# Altium schematic sheet window-watchdog.SchDoc
size A3; DocumentNumber: 40; SheetNumber: 40; SheetTotal: 45; SheetDescription: Window Watchdog
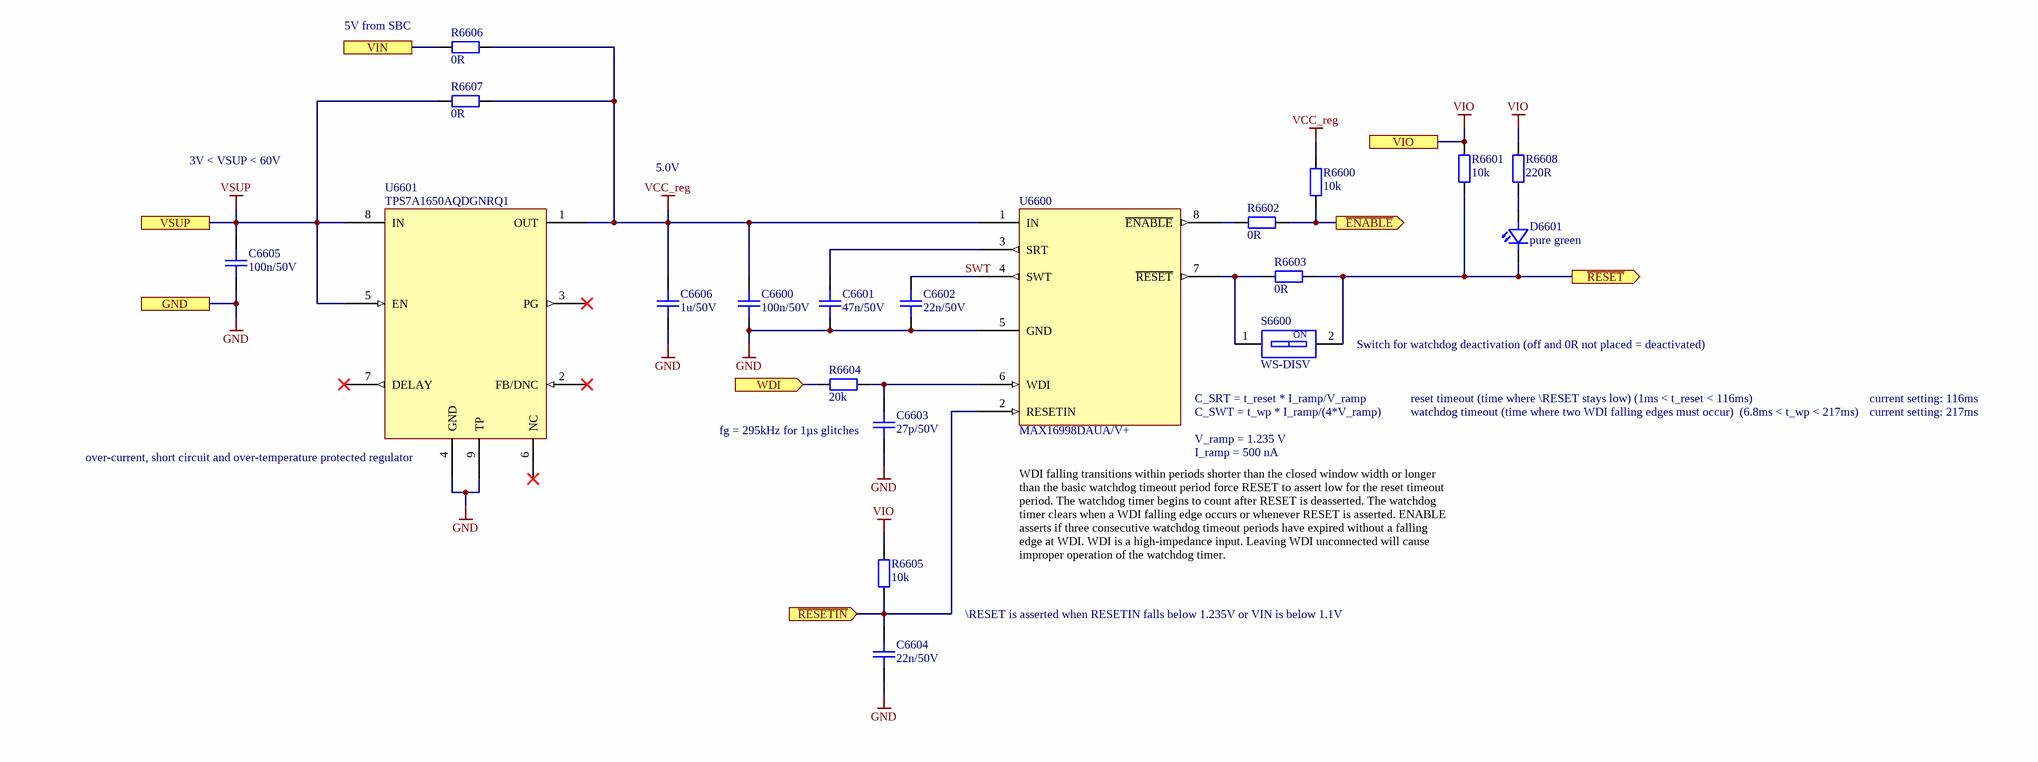
[diagram p0: window-watchdog.SchDoc]

## Parts
C6600  100n/50V  [CAPC1005X06N]
C6601  47n/50V  [CAPC1005X06N]
C6602  22n/50V  [CAPC1005X06N]
C6603  27p/50V  [CAPC1608X08N]
C6604  22n/50V  [CAPC1005X06N]
C6605  100n/50V  [CAPC1005X06N]
C6606  1u/50V  [CAPC1608X08N]
D6601  pure green  [LEDC1608X07N]
R6600  10k  [RESC1005X04N]
R6601  10k  [RESC1005X04N]
R6602  0R  [RESC1005X04N]
R6603  0R  [RESC1005X04N]
R6604  20k  [RESC1005X04N]
R6605  10k  [RESC1005X04N]
R6606  0R  [RESC1005X04N]
R6607  0R  [RESC1005X04N]
R6608  220R  [RESC1005X04N]
S6600  WS-DISV  [WE_416131160801]
U6600  MAX16998DAUA/V+  [MAX16998-uSOP8]
U6601  TPS7A1650AQDGNRQ1  [TPS7A16A-Q1]

## Ports
GND, VIN, VIO, VSUP, WDI (in), ~{ENABLE} (out), ~{RESETIN} (in), ~{RESET} (out)

## Nets
GND: C6600.1 C6601.1 C6602.1 C6603.1 C6604.1 C6605.1 C6606.1 U6600.5(GND) U6601.4(GND) U6601.9(TP) ; port GND
VCC_reg: C6600.2 C6606.2 R6600.2 R6606.2 R6607.2 U6600.1(IN) U6601.1(OUT)
VIO: R6601.2 R6605.2 R6608.2 ; port VIO
VSUP: C6605.2 R6607.1 U6601.5(EN) U6601.8(IN) ; port VSUP
~{ENABLE}: R6600.1 R6602.2 ; port ~{ENABLE}
~{RESET}: D6601.1(C) R6601.1 R6603.2 S6600.2 ; port ~{RESET}
~{RESETIN}: C6604.2 R6605.1 U6600.2(RESETIN) ; port ~{RESETIN}
SWT: C6602.2 U6600.4(SWT)
VIN: R6606.1 ; port VIN
WDI: R6604.1 ; port WDI
NetC6601_2: C6601.2 U6600.3(SRT)
NetC6603_2: C6603.2 R6604.2 U6600.6(WDI)
NetD6601_2: D6601.2(A) R6608.1
NetR6602_1: R6602.1 U6600.8(~{ENABLE})
NetR6603_1: R6603.1 S6600.1 U6600.7(~{RESET})

Not connected (* = marked no-connect by the designer): U6601 2(FB/DNC)* 3(PG)* 6(NC)* 7(DELAY)*

## Notes on the sheet
- (near R6606) 5V from SBC
- 3V < VSUP < 60V
- 5.0V
- (near S6600) Switch for watchdog deactivation (off and 0R not placed = deactivated)
- (near C6603) fg = 295kHz for 1µs glitches
- (near U6600) C_SRT = t_reset * I_ramp/V_ramp
- (near U6600) V_ramp = 1.235 V
- (near U6600) C_SWT = t_wp * I_ramp/(4*V_ramp)
- reset timeout (time where \RESET stays low) (1ms < t_reset < 116ms)
- watchdog timeout (time where two WDI falling edges must occur)  (6.8ms < t_wp < 217ms)
- current setting: 217ms
- current setting: 116ms
- (near U6601) over-current, short circuit and over-temperature protected regulator
- (near U6600) I_ramp = 500 nA
- WDI falling transitions within periods shorter than the closed window width or longer than the basic watchdog timeout period force RESET to assert low for the reset timeout period. The watchdog timer begins to count after RESET is deasserted. The watchdog timer clears when a WDI falling edge occurs or whenever RESET is asserted. ENABLE asserts if three consecutive watchdog timeout periods have expired without a falling edge at WDI. WDI is a high-impedance input. Leaving WDI unconnected will cause improper operation of the watchdog timer.
- \RESET is asserted when RESETIN falls below 1.235V or VIN is below 1.1V
- Fraunhofer IISB
- Schottkystr. 10
- developed by:
- 91058 Erlangen
- Germany
- Author
- Project
- License
- Description
- File
- Version
- Release Date
- Sheet
- foxbms.org <https://foxbms.org>
- www.iisb.fraunhofer.de <https://www.iisb.fraunhofer.de/>
- foxBMS Team
- /
- (in symbol WE_416131160801) ON

## Library data of the parts
C6600 C6605 = gen_C_ceramic_100n_50V_X7R_0402: MLCC; Capacitance: 100n; Rated Voltage: 50V; Dielectric: X7R; Case EIA: 0402; Case Metric: 1005; PnP Package: 0402C; PnP Value: 100nF/50V/X7R; PnP equipped: x; Automotive Qualified: True; AEC-Q Norm: AEC-Q200; Part Number: gen_C_ceramic_100n_50V_X7R_0402; Supplier 1: Farnell; Supplier Part Number 1: 2210822; ECCN: EAR99
C6601 = gen_C_ceramic_47n_50V_X7R_0402: MLCC; Capacitance: 47n; Rated Voltage: 50V; Dielectric: X7R; Case EIA: 0402; Case Metric: 1005; Automotive Qualified: True; PnP Package: 0402C; Part Number: gen_C_ceramic_47n_50V_X7R_0402; Supplier 1: Farnell; Supplier Part Number 1: 2210827
C6602 C6604 = gen_C_ceramic_22n_50V_X7R_0402: MLCC; Capacitance: 22n; Rated Voltage: 50V; Dielectric: X7R; Case EIA: 0402; Case Metric: 1005; Automotive Qualified: True; AEC-Q Grade: Grade 1; AEC-Q Norm: AEC-Q200; PnP Package: 0402C; Part Number: gen_C_ceramic_22n_50V_X7R_0402; ECCN: EAR99; Supplier 1: Digikey; Supplier Part Number 1: 490-4763-1-ND
C6603 = gen_C_ceramic_27p_50V_NP0_0603: MLCC; Capacitance: 27p; Rated Voltage: 50V; Dielectric: NP0; Case EIA: 0603; Case Metric: 1608; PnP Package: 0603C; Automotive Qualified: True; Part Number: gen_C_ceramic_27p_50V_NP0_0603; Supplier 1: Farnell; Supplier Part Number 1: 2219430
C6606 = gen_C_ceramic_1u_50V_X7R_0603: MLCC; Capacitance: 1u; Rated Voltage: 50V; Dielectric: X7R; Case EIA: 0603; Case Metric: 1608; Automotive Qualified: False; Tolerance: ± 10%; PnP Package: 0603C; Part Number: gen_C_ceramic_1u_50V_X7R_0603; Operating Temperature: -55°C - +125°C; Supplier 1: Farnell; Supplier Part Number 1: 2779055
D6601 = LED_0603_pure_green_AECQ: TLMP1100-GS08; Manufacturer: Vishay; Breakdown Voltage: 5V; Continuous Forward Current: 20mA; Forward Voltage @ 20mA: 2.1V; Automotive Qualified: True; Part Number: LED_0603_pure_green_AECQ; Color: pure green; Operating Temperature: -40°C - 100°C; ComponentLink1Description: Datasheet; ComponentLink1URL: http://www.farnell.com/datasheets/2049164.pdf; Supplier 1: Farnell; Supplier Part Number 1: 1328306; Supplier 2: Digikey; Supplier Part Number 2: 751-1176-1-ND; PnP Package: LED_0603
R6600 R6601 R6605 = gen_R_10k_0402: SMD Resistor 10k 0402; Tolerance: 1%; Power: 0.063W; Case EIA: 0402; Case Metric: 1005; Maximum Working Voltage: 50V; PnP Package: 0402R; PnP equipped: x; Automotive Qualified: True; AEC-Q Norm: AEC-Q200; Part Number: gen_R_10k_0402; Operating Temperature: -55°C - +155°C; Resistance: 10k; Series: E24, E96; PnP Value: 10k; Supplier 1: Farnell; Supplier Part Number 1: 2059239; ECCN: EAR99
R6602 R6603 R6606 R6607 = gen_R_0R_0402: SMD Resistor 0R 0402; Power: 0.063W; Case EIA: 0402; Case Metric: 1005; Maximum Working Voltage: 50V; PnP Package: 0402R; Automotive Qualified: True; AEC-Q Norm: AEC-Q200; PnP equipped: x; Part Number: gen_R_0R_0402; Operating Temperature: -55°C - +155°C; Resistance: 0R; Series: Jumper; PnP Value: 0R; Supplier 1: Farnell; Supplier Part Number 1: 1469661; Supplier 2: Farnell; Supplier Part Number 2: 2059190; ECCN: EAR99
R6604 = gen_R_20k_0402: SMD Resistor 20k 0402; Tolerance: 1%; Power: 0.063W; Case EIA: 0402; Case Metric: 1005; Maximum Working Voltage: 50V; PnP Package: 0402R; Automotive Qualified: True; PnP equipped: x; AEC-Q Norm: AEC-Q200; Part Number: gen_R_20k_0402; Operating Temperature: -55°C - +155°C; Resistance: 20k; Series: E24, E96; PnP Value: 20k; Supplier 1: Farnell; Supplier Part Number 1: 2059242; Supplier 2: Farnell; Supplier Part Number 2: 2059160; ECCN: EAR99
R6608 = gen_R_220R_0402: SMD Resistor 220R 0402; Tolerance: 1%; Power: 0.063W; Case EIA: 0402; Case Metric: 1005; Maximum Working Voltage: 50V; PnP Package: 0402R; Automotive Qualified: True; AEC-Q Norm: AEC-Q200; AEC-Q Grade: Grade 0; Part Number: gen_R_220R_0402; Operating Temperature: -55°C - +155°C; Resistance: 220R; Series: E24; PnP Value: 220R; Supplier 1: Digikey; Supplier Part Number 1: A129619CT-ND; ECCN: EAR99
S6600 = WE_416131160801: WS-DISV Small Compact SMT DipSwitch; Manufacturer: Würth Elektronik; Automotive Qualified: False; Part Number: WE_416131160801; Part Name: WS-DISV; Operating Temperature: -40°C - +85°C; ComponentLink1Description: Datasheet; ComponentLink1URL: https://www.we-online.de/katalog/datasheet/418121270801.pdf; Supplier 1: Digikey; Supplier Part Number 1: 732-3851-1-ND; Supplier 2: Mouser; Supplier Part Number 2: 710-416131160801
U6600 = MAX16998DAUA/V+: High-Voltage Watchdog Timers with Adjustable Timeout Delay; Manufacturer: Maxim Integrated; PnP Package: uSOP-8; Automotive Qualified: True; Part Number: MAX16998DAUA/V+; Part Name: MAX16998DAUA/V+; Operating Temperature: −40°C - +125°C; ComponentLink1Description: Datasheet; ComponentLink1URL: https://www.mouser.de/datasheet/2/256/MAX16997-MAX16998-1292640.pdf; Supplier 1: Mouser; Supplier Part Number 1: 700-MAX16998DAUA/V+
U6601 = TPS7A1650AQDGNRQ1: Automotive 60-V, 5-µA IQ, 100-mA low-dropout (LDO) voltage regulator with enable and power good; Manufacturer: Texas Instruments; PnP Package: HVSSOP-8; Automotive Qualified: True; AEC-Q Norm: AEC-Q100; AEC-Q Grade: Grade 1; Part Number: TPS7A1650AQDGNRQ1; Part Name: TPS7A16A-Q1; Operating Temperature: -40°C - +125°C; ComponentLink1Description: Datasheet; ComponentLink1URL: http://www.ti.com/lit/ds/symlink/tps7a16a-q1.pdf; Supplier 1: Mouser; Supplier Part Number 1: 595-PS7A1650AQDGNRQ1; Supplier 2: Digikey; Supplier Part Number 2: 296-TPS7A1650AQDGNRQ1TR-ND; ECCN: EAR99